# EAGLE design POESP32 (EAGLE 9.0.1)
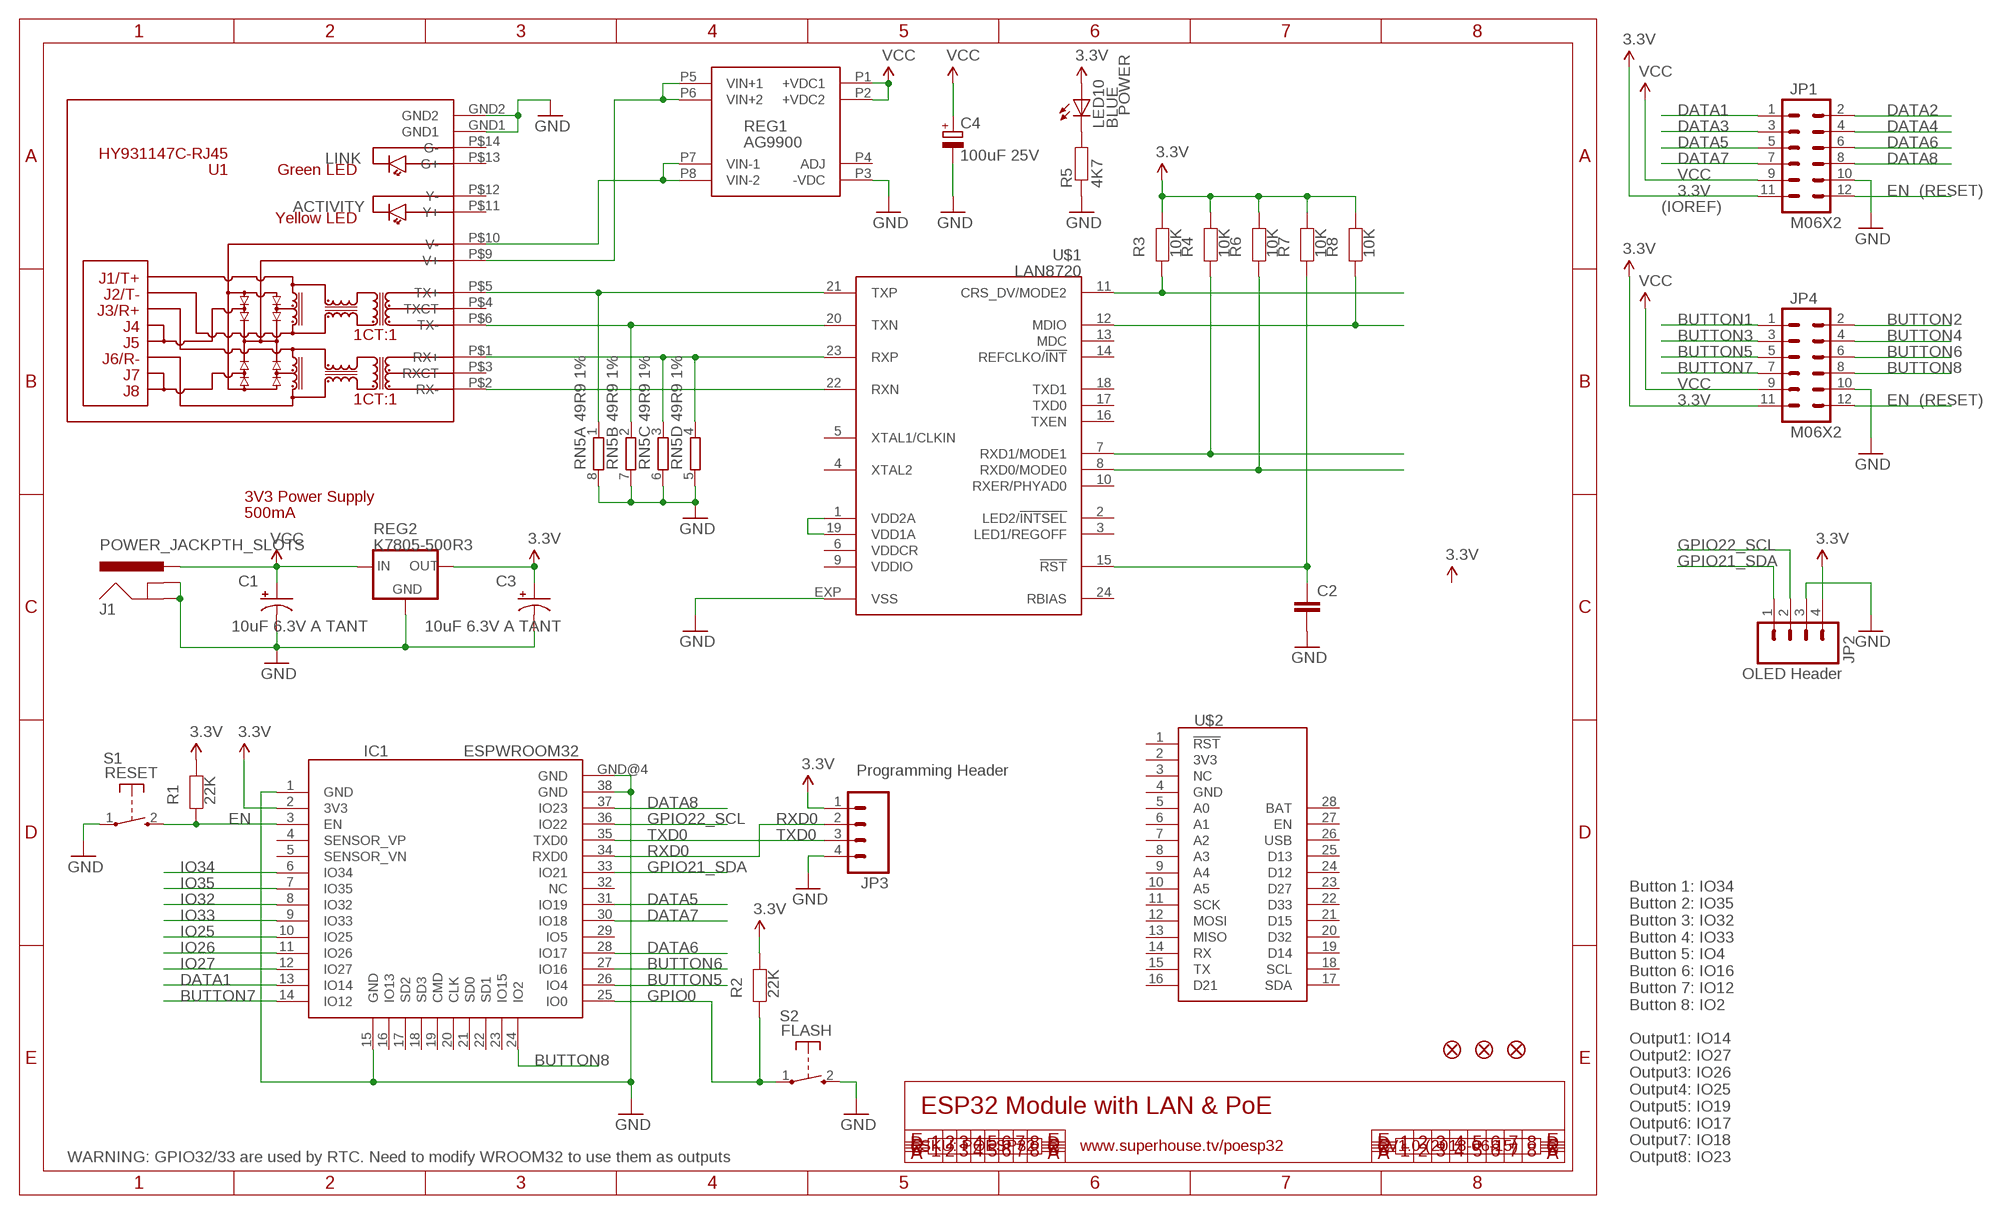
[diagram p0: schematic, sheet 1]

## Parts
C1  10uF 6.3V A TANT  CAP_POL1206  [EIA3216]
C2  CAP0805  [0805]
C3  10uF 6.3V A TANT  CAP_POL1206  [EIA3216]
C4  100uF 25V  CPOL-EUD  [PANASONIC_D]
FID1  FIDUCIAL1X2.5  [FIDUCIAL-1X2.5]
FID2  FIDUCIAL1X2.5  [FIDUCIAL-1X2.5]
FID3  FIDUCIAL1X2.5  [FIDUCIAL-1X2.5]
IC1  ESPWROOM32  [ESPWROOM32]
J1  POWER_JACKPTH_SLOTS  [POWER_JACK_PTH_SLOTS]
JP1  M06X2  [2X6-SHROUDED]
JP2  M04PTH  [1X04]
JP3  M04PTH  [1X04]
JP4  M06X2  [2X6-SHROUDED]
LED10  BLUE  LED0603  [LED-0603]
R1  22K  RESISTOR0603  [0603@2]
R2  22K  RESISTOR0603  [0603@2]
R3  10K  RESISTOR0603  [0603@2]
R4  10K  RESISTOR0603  [0603@2]
R5  4K7  RESISTOR0603  [0603]
R6  10K  RESISTOR0603  [0603@2]
R7  10K  RESISTOR0603  [0603@2]
R8  10K  RESISTOR0603  [0603@2]
REG1  AG9900  [AG9900]
REG2  K7805-500R3  K78XX-500R3  [K78XX-500R3]
RN5  49R9 1%  4R-NCAY16  [CAY16]
S1  RESET  TAC_SWITCH_2PINSMT  [TACTILE_SWITCH_SMD_2PIN_TINY]
S2  FLASH  TAC_SWITCH_2PINSMT  [TACTILE_SWITCH_SMD_2PIN_TINY]
U1  HY931147C-RJ45  [HY931147C]
U$1  LAN8720  [QFN24]
U$2  FEATHER  [FEATHER]

## Nets
3.3V: C3.A(+) IC1.2(3V3) JP1.11 JP2.4 JP3.1 JP4.11 LED10.A R1.1 R2.1 R3.1 R4.1 R6.1 R7.1 R8.1 REG2.3(OUT)
BUTTON1: JP4.1
BUTTON2: JP4.2
BUTTON3: JP4.3
BUTTON4: JP4.4
BUTTON5: IC1.26(IO4) JP4.5
BUTTON6: IC1.27(IO16) JP4.6
BUTTON7: IC1.14(IO12) JP4.7
BUTTON8: IC1.24(IO2) JP4.8
DATA1: IC1.13(IO14) JP1.1
DATA2: JP1.2
DATA3: JP1.3
DATA4: JP1.4
DATA5: IC1.31(IO19) JP1.5
DATA6: IC1.28(IO17) JP1.6
DATA7: IC1.30(IO18) JP1.7
DATA8: IC1.37(IO23) JP1.8
EN: IC1.3(EN) JP1.12 JP4.12 R1.2 S1.2(S)
GND: C1.C(-) C2.2 C3.C(-) C4.- IC1.1(GND) IC1.15(GND) IC1.38(GND) IC1.GND@4(GND) J1.GND J1.GNDBREAK JP1.10 JP2.3 JP3.4 JP4.10 R5.1 REG1.P3(-VDC) REG2.2(GND) RN5.5 RN5.6 RN5.7 RN5.8 S1.1(P) S2.2(S) U1.GND1 U1.GND2 U$1.EXP(VSS)
GPIO0: IC1.25(IO0) R2.2 S2.1(P)
GPIO21_SDA: IC1.33(IO21) JP2.1
GPIO22_SCL: IC1.36(IO22) JP2.2
IO25: IC1.10(IO25)
IO26: IC1.11(IO26)
IO27: IC1.12(IO27)
IO32: IC1.8(IO32)
IO33: IC1.9(IO33)
IO34: IC1.6(IO34)
IO35: IC1.7(IO35)
N$1: RN5.1 U1.P$5(TX+) U$1.21(TXP)
N$2: REG1.P5(VIN+1) REG1.P6(VIN+2) U1.P$9(V+)
N$3: REG1.P7(VIN-1) REG1.P8(VIN-2) U1.P$10(V-)
N$4: RN5.2 U1.P$6(TX-) U$1.20(TXN)
N$5: RN5.3 RN5.4 U1.P$1(RX+) U$1.23(RXP)
N$6: U1.P$2(RX-) U$1.22(RXN)
N$7: U$1.1(VDD2A) U$1.19(VDD1A)
N$8: R4.2 U$1.7(RXD1/MODE1)
N$9: R6.2 U$1.8(RXD0/MODE0)
N$11: R3.2 U$1.11(CRS_DV/MODE2)
N$12: C2.1 R7.2 U$1.15(!RST)
N$13: R8.2 U$1.12(MDIO)
N$14: LED10.C R5.2
RXD0: IC1.34(RXD0) JP3.2
TXD0: IC1.35(TXD0) JP3.3
VCC: C1.A(+) C4.+ J1.PWR JP1.9 JP4.9 REG1.P1(+VDC1) REG1.P2(+VDC2) REG2.1(IN)
Unconnected: IC1.4(SENSOR_VP) IC1.5(SENSOR_VN) IC1.16(IO13) IC1.17(SD2) IC1.18(SD3) IC1.19(CMD) IC1.20(CLK) IC1.21(SD0) IC1.22(SD1) IC1.23(IO15) IC1.29(IO5) IC1.32(NC) REG1.P4(ADJ) U1.P$3(RXCT) U1.P$4(TXCT) U1.P$11(Y+) U1.P$12(Y-) U1.P$13(G+) U1.P$14(G-) U$1.2(LED2/!INTSEL) U$1.3(LED1/REGOFF) U$1.4(XTAL2) U$1.5(XTAL1/CLKIN) U$1.10(RXER/PHYAD0) U$1.13(MDC) U$1.14(REFCLKO/!INT) U$1.16(TXEN) U$1.17(TXD0) U$1.18(TXD1) U$1.24(RBIAS) U$2.1(!RST) U$2.2(3V3) U$2.3(NC) U$2.4(GND) U$2.5(A0) U$2.6(A1) U$2.7(A2) U$2.8(A3) U$2.9(A4) U$2.10(A5) U$2.11(SCK) U$2.12(MOSI) U$2.13(MISO) U$2.14(RX) U$2.15(TX) U$2.16(D21) U$2.17(SDA) U$2.18(SCL) U$2.19(D14) U$2.20(D32) U$2.21(D15) U$2.22(D33) U$2.23(D27) U$2.24(D12) U$2.25(D13) U$2.26(USB) U$2.27(EN) U$2.28(BAT)

## Notes on the sheet
- POWER
- LINK
- (RESET)
- ACTIVITY | (IOREF)
- (RESET)
- 3V3 Power Supply
- 500mA
- OLED Header
- Programming Header
- ESP32 Module with LAN & PoE
- SKU: POESP32 | www.superhouse.tv/poesp32 | V1.0 (2018-06-15)
- WARNING: GPIO32/33 are used by RTC. Need to modify WROOM32 to use them as outputs
- Button 1: IO34
  Button 2: IO35
  Button 3: IO32
  Button 4: IO33
  Button 5: IO4
  Button 6: IO16
  Button 7: IO12
  Button 8: IO2
  
  Output1: IO14
  Output2: IO27
  Output3: IO26
  Output4: IO25
  Output5: IO19
  Output6: IO17
  Output7: IO18
  Output8: IO23

## Power pins joined to a net without a drawn wire
VDDCR: U$1.6(VDDCR)
VDDIO: U$1.9(VDDIO)

## Library data of the parts
C1 C3 = freetronics:CAP_POL: Capacitor Polarized These are standard SMD and PTH capacitors. Normally 10uF, 47uF, and 100uF in electrolytic and tantalum varieties. Always verify the external diameter of the through hole cap, it varies with capacity, voltage, and manufacturer. The EIA devices should be standard.
C2 = freetronics-jon:CAP: Capacitor Standard 0603 ceramic capacitor, and 0.1" leaded capacitor.
C4 = rcl:CPOL-EU: POLARIZED CAPACITOR, European symbol
FID1-FID3 = freetronics:FIDUCIAL: Fiducial Alignment Points Various fiducial points for machine vision alignment.
IC1 = freetronics-jon:ESPWROOM32
J1 = freetronics-jon:POWER_JACK: Power Jack This is the standard 5.5mm barrel jack for power. The PTH is the most common, proven, reliable, footprint. All others are experimental. The Slot footprint only works if the mill layer is transmitted to the PCB fab house so be warned. Spark Fun Electronics SKU : PRT-00119. Mating wall wart : TOL-00298 (and others)
JP1 JP4 = freetronics-jon:M06X2
JP2 JP3 = freetronics-jon:M04: Header 4 Standard 4-pin 0.1" header. Use with straight break away headers (SKU : PRT-00116), right angle break away headers (PRT-00553), swiss pins (PRT-00743), machine pins (PRT-00117), and female headers (PRT-00115). Molex polarized connector foot print use with SKU : PRT-08231 with associated crimp pins and housings. 1MM SMD Version SKU: PRT-10208
LED10 = freetronics-jon:LED: LEDs Standard schematic elements and footprints for 5mm, 3mm, 1206, and 0603 sized LEDs. 5mm - Spark Fun Electronics SKU : COM-00529 (and others)
R1-R4 R6-R8 = freetronics:RESISTOR: Resistor Basic schematic elements and footprints for 0603, 1206, and PTH 1/10th watt (small) resistors.
R5 = freetronics-jon:RESISTOR: Resistor Basic schematic elements and footprints for 0603, 1206, and PTH 1/10th watt (small) resistors.
REG1 = freetronics-jon:AG9900
REG2 = freetronics-jon:K78XX-500R3
RN5 = freetronics-master-v1:4R-N: Array Chip Resistor Source: RS Component / Phycomp
S1 S2 = freetronics-jon:TAC_SWITCH_2PIN: Momentary Tactile Switch - 2 pin
U1 = freetronics-jon:HY931147C
U$1 = microchip-smsc-lan8720:LAN8720: LAN8720A/LAN8720Ai Small Footprint RMII 10/100 Ethernet PHY Transceiver with HP Auto-MDIX Support from SMSC / Microchip <http://www.microchip.com>. (C) 2014 Tomasz Boleslaw CEDRO, cederom@tlen.pl, http://www.tomek.cedro.info. Version 0.1 (2014-01-04): Initial release.
U$2 = freetronics-jon:FEATHER: Feather footprint

## Net classes
0 Default: width 0.203 mm
1 VCC: width 0.305 mm

## Board
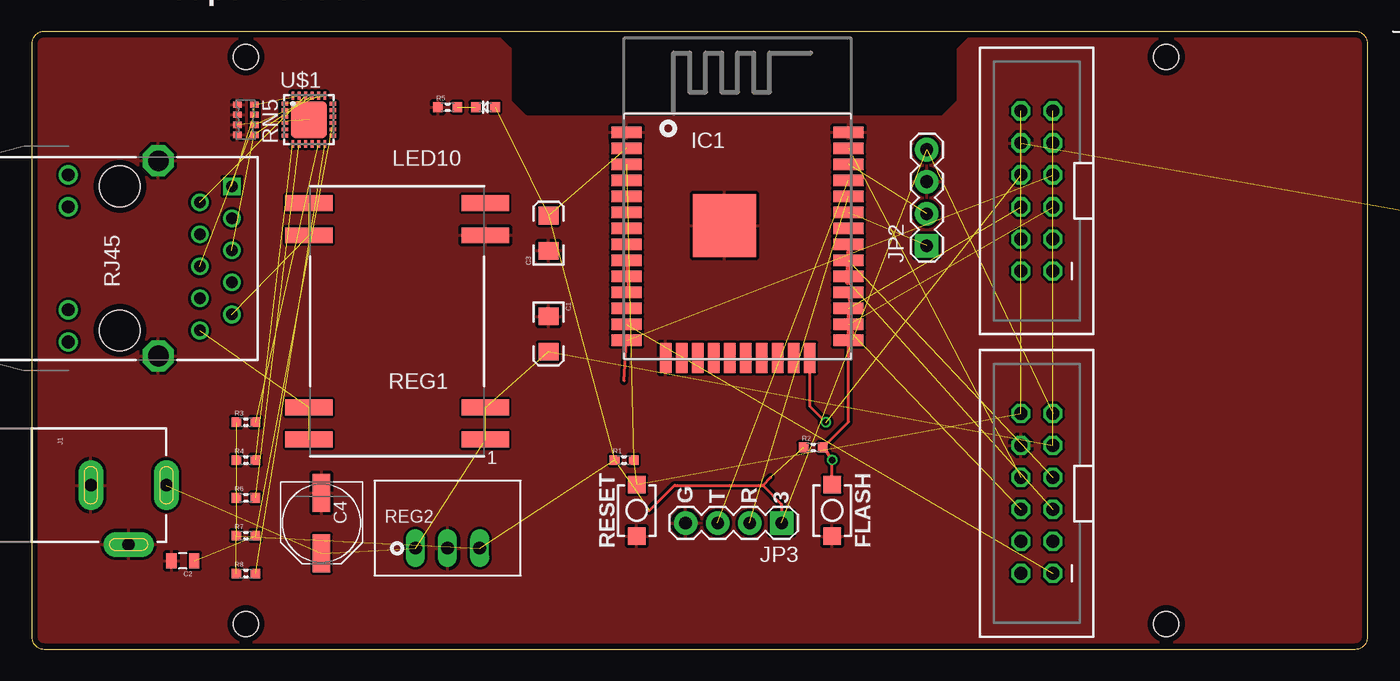
[diagram p1: board, top side]
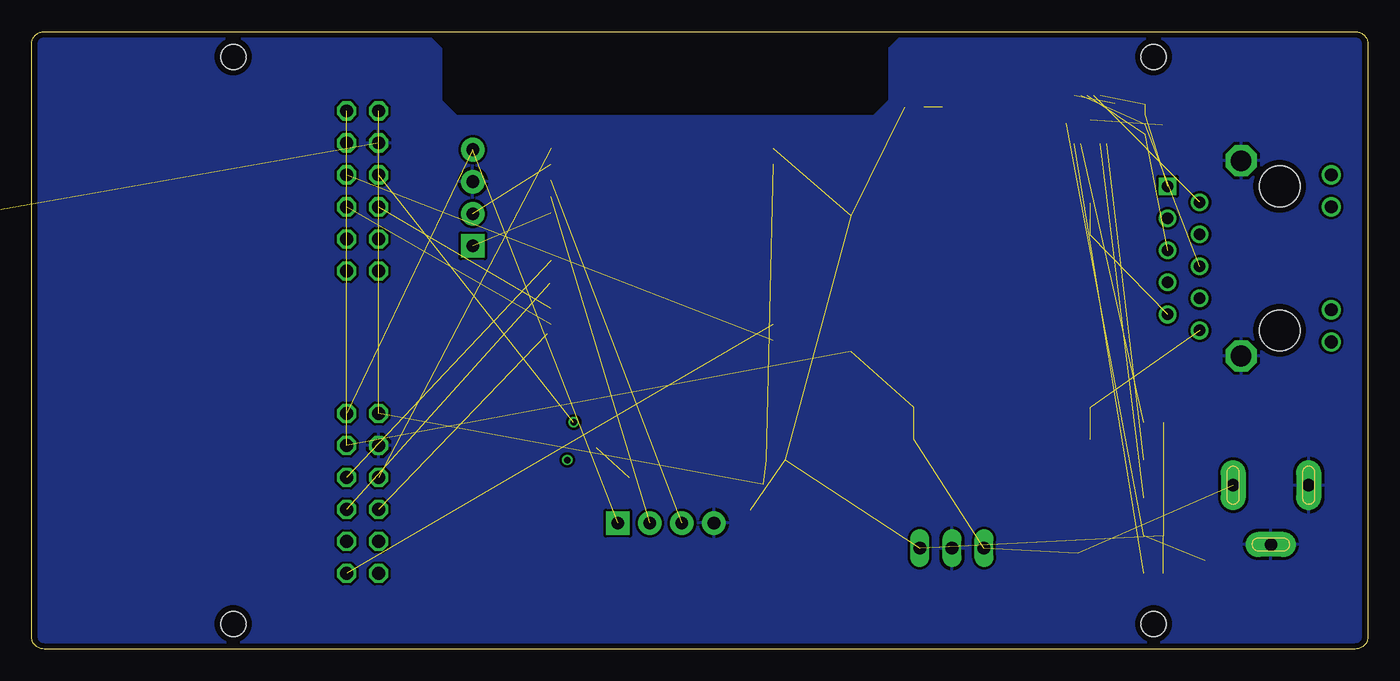
[diagram p2: board, bottom side, seen from below]

Size 106 x 49 mm. Coordinates in mm from the lower left corner, seen from the top.
Outline: 105,49 1,49 arc90 0,48 0,1 arc90 1,0 105,0 arc90 106,1 106,48 arc90 105,49
Copper layers (1*16): Top 0.035mm / dielectric 1.5mm / Bottom 0.035mm
Design rules "default": minimum track width 8mil, minimum drill 15mil, track to track 8mil, track to pad 8mil, pad to pad 8mil, via to via 8mil, smd to smd 8mil, copper to edge 18mil, drill to drill 8mil, minimum pad ring 10mil, minimum via ring 6mil, stop-mask expansion 4mil, vias tented up to drill 25mil, thermal gap 10mil
Holes 2 mm at 17,2 17,47 90,2 90,47
tRestrict: area 109,28 to 111,30; area 109.5,21 to 111.5,23; area 109,40 to 111,42

### Footprints (pad centres in the part's own frame; a part is rotated, then mirrored left to right if it is on the bottom)
EIA3216 = smd 1.4 x 1.6: A 1.4,0; C -1.4,0
0805 = smd 0.8 x 1.2: 1 -0.9,0; 2 0.9,0
PANASONIC_D = smd 3 x 1.4: + 2.4,0; - -2.4,0
FIDUCIAL-1X2.5 = smd 1 x 1: 1 0,0
ESPWROOM32 = smd 2.4 x 0.9: 1 -8.8,-1.5; 2 -8.8,-2.77; 3 -8.8,-4.04; 4 -8.8,-5.31; 5 -8.8,-6.58; 6 -8.8,-7.85; 7 -8.8,-9.12; 8 -8.8,-10.39; 9 -8.8,-11.66; 10 -8.8,-12.93; 11 -8.8,-14.2; 12 -8.8,-15.47; 13 -8.8,-16.74; 14 -8.8,-18.01; 25 8.8,-18.01; 26 8.8,-16.74; 27 8.8,-15.47; 28 8.8,-14.2; 29 8.8,-12.93; 30 8.8,-11.66; 31 8.8,-10.39; 32 8.8,-9.12; 33 8.8,-7.85; 34 8.8,-6.58; 35 8.8,-5.31; 36 8.8,-4.04; 37 8.8,-2.77; 38 8.8,-1.5 | smd 0.9 x 2.4: 15 -5.7,-19.4; 16 -4.43,-19.4; 17 -3.16,-19.4; 18 -1.89,-19.4; 19 -0.62,-19.4; 20 0.65,-19.4; 21 1.92,-19.4; 22 3.19,-19.4; 23 4.46,-19.4; 24 5.73,-19.4 | smd 5 x 5: GND@4 -1.03,-8.89
POWER_JACK_PTH_SLOTS = drill 1 pad 2 long: GND 0,7.7; GNDBREAK 4.7,10.7; PWR 0,13.7
2X6-SHROUDED = drill 1.016 octagon: 1 0,0; 2 2.54,0; 3 0,-2.54; 4 2.54,-2.54; 5 0,-5.08; 6 2.54,-5.08; 7 0,-7.62; 8 2.54,-7.62; 9 0,-10.16; 10 2.54,-10.16; 11 0,-12.7; 12 2.54,-12.7
1X04 = drill 1.016 pad 1.88 square: 1 0,0 | drill 1.016 pad 1.88: 2 2.54,0; 3 5.08,0; 4 7.62,0
LED-0603 = smd 0.762 x 0.762: A -0.762,0; C 0.762,0
0603@2 = smd 0.762 x 0.762: 1 -0.762,0; 2 0.762,0
0603 = smd 0.762 x 0.762: 1 -0.762,0; 2 0.762,0
AG9900 = smd 3.75 x 1.25: P1 -7,9.375; P2 -7,6.835; P3 -7,-6.835; P4 -7,-9.375; P5 7,-9.375; P6 7,-6.835; P7 7,6.835; P8 7,9.375
K78XX-500R3 = drill 1 long: 1 -2.54,0; 2 0,0; 3 2.54,0
CAY16 = smd 0.5 x 0.65: 1 -1.2,-0.675; 2 -0.4,-0.675; 3 0.4,-0.675; 4 1.2,-0.675; 5 1.2,0.675; 6 0.4,0.675; 7 -0.4,0.675; 8 -1.2,0.675
TACTILE_SWITCH_SMD_2PIN_TINY = smd 1.4 x 1.4: 1 -2.05,0; 2 2.05,0
HY931147C = drill 1.63 octagon: GND1 3.05,7.745; GND2 3.05,-7.745 | drill 0.9 square: P$1 8.89,5.715 | drill 0.9: P$2 6.35,4.445; P$3 8.89,3.175; P$4 6.35,1.905; P$5 8.89,0.635; P$6 6.35,-0.635; P$7 8.89,-1.905; P$8 6.35,-3.175; P$9 8.89,-4.445; P$10 6.35,-5.715 | drill 1.016: P$11 -4.08,6.625; P$12 -4.08,4.085; P$13 -4.08,-4.085; P$14 -4.08,-6.625 | hole 3.25: 0,5.715; 0,-5.715
QFN24 = smd 0.6 x 0.3: 1 -1.905,1.27; 2 -1.905,0.762; 3 -1.905,0.254; 4 -1.905,-0.254; 5 -1.905,-0.762; 6 -1.905,-1.27; 13 1.905,-1.27; 14 1.905,-0.762; 15 1.905,-0.254; 16 1.905,0.254; 17 1.905,0.762; 18 1.905,1.27 | smd 0.3 x 0.6: 7 -1.27,-1.905; 8 -0.762,-1.905; 9 -0.254,-1.905; 10 0.254,-1.905; 11 0.762,-1.905; 12 1.27,-1.905; 19 1.27,1.905; 20 0.762,1.905; 21 0.254,1.905; 22 -0.254,1.905; 23 -0.762,1.905; 24 -1.27,1.905 | smd 2.9 x 2.9: EXP 0,0
FEATHER = drill 1: 1 -10.16,17.78; 2 -10.16,15.24; 3 -10.16,12.7; 4 -10.16,10.16; 5 -10.16,7.62; 6 -10.16,5.08; 7 -10.16,2.54; 8 -10.16,0; 9 -10.16,-2.54; 10 -10.16,-5.08; 11 -10.16,-7.62; 12 -10.16,-10.16; 13 -10.16,-12.7; 14 -10.16,-15.24; 15 -10.16,-17.78; 16 -10.16,-20.32; 17 10.16,-20.32; 18 10.16,-17.78; 19 10.16,-15.24; 20 10.16,-12.7; 21 10.16,-10.16; 22 10.16,-7.62; 23 10.16,-5.08; 24 10.16,-2.54; 25 10.16,0; 26 10.16,2.54; 27 10.16,5.08; 28 10.16,7.62

### Placement (x,y rotation side)
C1  41,25 270 top
C2  12,7 180 top
C3  41,33 90 top
C4  23,10 270 top
FID1  110,29 180 top  (outside the outline)
FID2  110.5,22 180 top  (outside the outline)
FID3  110,41 180 top  (outside the outline)
IC1  56,42.5 0 top
J1  -3,13 270 top
JP1  81,6 180 top
JP2  71,32 90 top
JP3  59.5,10 180 top
JP4  81,30 180 top
LED10  36,43 180 top
R1  47,15 0 top
R2  62,16 0 top
R3  17,18 0 top
R4  17,15 0 top
R5  33,43 0 top
R6  17,12 0 top
R7  17,9 0 top
R8  17,6 0 top
REG1  29,26 180 top
REG2  33,8 0 top
RN5  17,42 90 top
S1  48,11 90 top
S2  63.5,11 270 top
U1  7,31 0 top
U$1  22,42 0 top
U$2  29,68 90 top  (outside the outline)

### Tracks (layer width: path | path; a pad name or v marks a point on that pad's centre or on a via)
3.3V  (14 unrouted)
  Top 0.254: 49,11 51,13 58,13 | 58,13 59.5,11.5 JP3.1 | 58.62,13.62 58,13
BUTTON5  (1 unrouted)
BUTTON6  (1 unrouted)
  Top 0.254: 64.81,24.04 IC1.27 64.83,24
BUTTON7  (1 unrouted)
  Top 0.254: 47,21.29 IC1.14
BUTTON8  (via drill 0.5)  (1 unrouted)
  Top 0.254: v63,18 61.73,19.27 IC1.24
DATA1  (1 unrouted)
DATA5  (1 unrouted)
  Top 0.254: 64.91,29 IC1.31 64.69,29
DATA6  (1 unrouted)
  Top 0.254: IC1.28 65.1,25
DATA7  (1 unrouted)
DATA8  (1 unrouted)
EN  (4 unrouted)
GND  (via drill 0.5)  (2 unrouted)
  other vias: 64.4,63.48 110.67,34.48 62.5,62 64,61 65.5,62 62.67,64.48 66.17,64.48 61.67,63.48 64.17,65.48
  pour Bottom: 105,0 1,0 arc-90 0,1 0,48 arc-90 1,49 1.09,48.91 36.7,48.91 37.97,47.64 37.97,43.52 39.24,42.25 72.26,42.25 73.53,43.52 73.53,47.64 74.8,48.91 105,49 arc-90 106,48 106,1 arc-90
  pour Top: 105,0 1,0 arc-90 0,1 0,48 arc-90 1,49 1.09,48.91 36.7,48.91 37.97,47.64 37.97,43.52 39.24,42.25 72.26,42.25 73.53,43.52 73.53,47.64 74.8,48.91 105,49 arc-90 106,48 106,1 arc-90
GPIO0  (via drill 0.5)
  Top 0.254: S2.1 v63.5,15 63,15.76 R2.2 64.8,18.04 IC1.25
GPIO21_SDA  (1 unrouted)
GPIO22_SCL  (1 unrouted)
IO33
  Top 0.254: IC1.9 47.36,28
N$1  (2 unrouted)
N$2  (2 unrouted)
N$3  (2 unrouted)
N$4  (2 unrouted)
N$5  (3 unrouted)
N$6  (1 unrouted)
N$7  (1 unrouted)
N$8  (1 unrouted)
N$9  (1 unrouted)
N$11  (1 unrouted)
N$12  (2 unrouted)
N$13  (1 unrouted)
N$14  (1 unrouted)
RXD0  (1 unrouted)
TXD0  (1 unrouted)
VCC  (7 unrouted)

### Text on the board
tPlace: ESP32 LAN / POE | v1.0 | by Jonathan Oxer | www.superhouse.tv | (C)2018 SuperHouse Automation P/L | G | T | R | 3 | RESET | FLASH